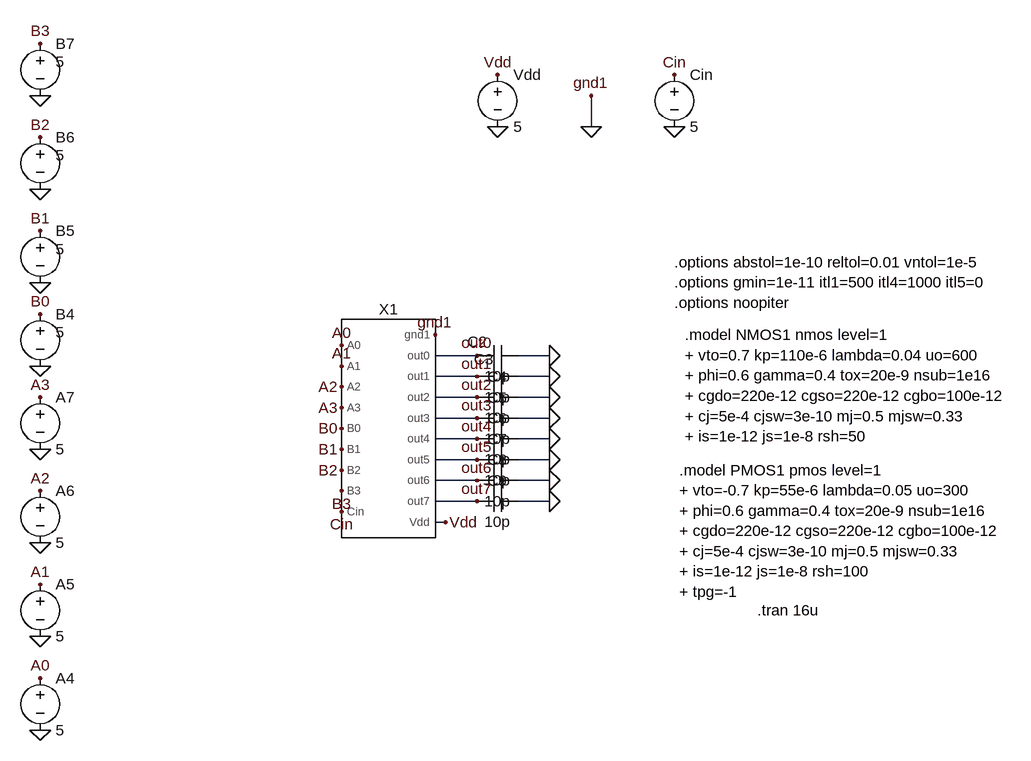
[diagram p0: schematic AddSub_TB.asc]
AddSub_TB.asc, the LTspice schematic file:
Version 4.1
SHEET 1 1768 1716
WIRE 1072 -272 1072 -320
WIRE 896 80 832 80
WIRE 1008 80 960 80
WIRE 896 112 832 112
WIRE 1008 112 960 112
WIRE 896 144 832 144
WIRE 1008 144 960 144
WIRE 896 176 832 176
WIRE 1008 176 960 176
WIRE 896 208 832 208
WIRE 1008 208 960 208
WIRE 896 240 832 240
WIRE 1008 240 960 240
WIRE 896 272 832 272
WIRE 1008 272 960 272
WIRE 896 304 832 304
WIRE 1008 304 960 304
WIRE 848 336 832 336
FLAG 928 -272 0
FLAG 1072 -272 0
FLAG 1072 -320 gnd1
FLAG 1200 -272 0
FLAG 1200 -352 Cin
FLAG 688 64 A0
FLAG 688 96 A1
FLAG 688 128 A2
FLAG 688 160 A3
FLAG 688 192 B0
FLAG 688 224 B1
FLAG 688 256 B2
FLAG 688 288 B3
FLAG 688 320 Cin
FLAG 896 80 out0
FLAG 896 112 out1
FLAG 896 144 out2
FLAG 896 176 out3
FLAG 896 208 out4
FLAG 896 240 out5
FLAG 896 272 out6
FLAG 896 304 out7
FLAG 848 336 Vdd
FLAG 928 -352 Vdd
FLAG 224 -320 0
FLAG 224 -32 0
FLAG 224 96 0
FLAG 224 224 0
FLAG 224 368 0
FLAG 224 512 0
FLAG 224 656 0
FLAG 224 576 A0
FLAG 224 432 A1
FLAG 224 288 A2
FLAG 224 144 A3
FLAG 224 16 B0
FLAG 224 -112 B1
FLAG 224 -256 B2
FLAG 224 -400 B3
FLAG 224 -176 0
FLAG 1008 80 0
FLAG 1008 112 0
FLAG 1008 144 0
FLAG 1008 176 0
FLAG 1008 208 0
FLAG 1008 240 0
FLAG 1008 272 0
FLAG 1008 304 0
FLAG 832 48 gnd1
SYMBOL AddSub 752 192 R0
SYMATTR InstName X1
SYMBOL voltage 928 -368 R0
SYMATTR InstName Vdd
SYMATTR Value 5
SYMBOL voltage 1200 -368 R0
WINDOW 123 0 0 Left 0
WINDOW 39 0 0 Left 0
SYMATTR InstName Cin
SYMATTR Value 5
SYMBOL voltage 224 560 R0
WINDOW 123 0 0 Left 0
WINDOW 39 0 0 Left 0
SYMATTR InstName A4
SYMATTR Value 5
SYMBOL voltage 224 416 R0
WINDOW 123 0 0 Left 0
WINDOW 39 0 0 Left 0
SYMATTR InstName A5
SYMATTR Value 5
SYMBOL voltage 224 272 R0
WINDOW 123 0 0 Left 0
WINDOW 39 0 0 Left 0
SYMATTR InstName A6
SYMATTR Value 5
SYMBOL voltage 224 128 R0
WINDOW 123 0 0 Left 0
WINDOW 39 0 0 Left 0
SYMATTR InstName A7
SYMATTR Value 5
SYMBOL voltage 224 0 R0
WINDOW 3 24 44 Left 2
WINDOW 123 0 0 Left 0
WINDOW 39 0 0 Left 0
SYMATTR Value 5
SYMATTR InstName B4
SYMBOL voltage 224 -128 R0
WINDOW 3 24 44 Left 2
WINDOW 123 0 0 Left 0
WINDOW 39 0 0 Left 0
SYMATTR Value 5
SYMATTR InstName B5
SYMBOL voltage 224 -272 R0
WINDOW 3 24 44 Left 2
WINDOW 123 0 0 Left 0
WINDOW 39 0 0 Left 0
SYMATTR Value 5
SYMATTR InstName B6
SYMBOL voltage 224 -416 R0
WINDOW 3 24 44 Left 2
WINDOW 123 0 0 Left 0
WINDOW 39 0 0 Left 0
SYMATTR Value 5
SYMATTR InstName B7
SYMBOL cap 960 64 R90
WINDOW 0 10 63 VBottom 2
WINDOW 3 32 32 VTop 2
SYMATTR InstName C2
SYMATTR Value 10p
SYMBOL cap 960 96 R90
WINDOW 0 5 53 VBottom 2
WINDOW 3 32 32 VTop 2
SYMATTR InstName C3
SYMATTR Value 10p
SYMBOL cap 960 128 R90
WINDOW 0 0 32 VBottom 2
WINDOW 3 32 32 VTop 2
SYMATTR InstName C4
SYMATTR Value 10p
SYMBOL cap 960 160 R90
WINDOW 0 0 32 VBottom 2
WINDOW 3 32 32 VTop 2
SYMATTR InstName C5
SYMATTR Value 10p
SYMBOL cap 960 192 R90
WINDOW 0 0 32 VBottom 2
WINDOW 3 32 32 VTop 2
SYMATTR InstName C6
SYMATTR Value 10p
SYMBOL cap 960 224 R90
WINDOW 0 0 32 VBottom 2
WINDOW 3 32 32 VTop 2
SYMATTR InstName C7
SYMATTR Value 10p
SYMBOL cap 960 256 R90
WINDOW 0 0 32 VBottom 2
WINDOW 3 32 32 VTop 2
SYMATTR InstName C8
SYMATTR Value 10p
SYMBOL cap 960 288 R90
WINDOW 0 0 32 VBottom 2
WINDOW 3 32 32 VTop 2
SYMATTR InstName C9
SYMATTR Value 10p
TEXT 1216 48 Left 2 !.model NMOS1 nmos level=1\n+ vto=0.7 kp=110e-6 lambda=0.04 uo=600\n+ phi=0.6 gamma=0.4 tox=20e-9 nsub=1e16\n+ cgdo=220e-12 cgso=220e-12 cgbo=100e-12\n+ cj=5e-4 cjsw=3e-10 mj=0.5 mjsw=0.33\n+ is=1e-12 js=1e-8 rsh=50
TEXT 1208 256 Left 2 !.model PMOS1 pmos level=1\n+ vto=-0.7 kp=55e-6 lambda=0.05 uo=300\n+ phi=0.6 gamma=0.4 tox=20e-9 nsub=1e16\n+ cgdo=220e-12 cgso=220e-12 cgbo=100e-12\n+ cj=5e-4 cjsw=3e-10 mj=0.5 mjsw=0.33\n+ is=1e-12 js=1e-8 rsh=100\n+ tpg=-1
TEXT 1328 472 Left 2 !.tran 16u
TEXT 1200 -64 Left 2 !.options abstol=1e-10 reltol=0.01 vntol=1e-5\n.options gmin=1e-11 itl1=500 itl4=1000 itl5=0\n.options noopiter

The netlist it stands for:
* AddSub_TB.asc
X§X1 A0 A1 A2 A3 B0 B1 B2 B3 Cin 0 out0 out1 out2 out3 out4 out5 out6 out7 Vdd AddSub  ; pins A0 A1 A2 A3 B0 B1 B2 B3 Cin gnd1 out0 out1 out2 out3 out4 out5 out6 out7 Vdd
Vdd Vdd 0 5
V§Cin Cin 0 5
V§A4 A0 0 5
V§A5 A1 0 5
V§A6 A2 0 5
V§A7 A3 0 5
V§B4 B0 0 5
V§B5 B1 0 5
V§B6 B2 0 5
V§B7 B3 0 5
C2 0 out0 10p
C3 0 out1 10p
C4 0 out2 10p
C5 0 out3 10p
C6 0 out4 10p
C7 0 out5 10p
C8 0 out6 10p
C9 0 out7 10p
.model NMOS1 nmos level=1
+ vto=0.7 kp=110e-6 lambda=0.04 uo=600
+ phi=0.6 gamma=0.4 tox=20e-9 nsub=1e16
+ cgdo=220e-12 cgso=220e-12 cgbo=100e-12
+ cj=5e-4 cjsw=3e-10 mj=0.5 mjsw=0.33
+ is=1e-12 js=1e-8 rsh=50
.model PMOS1 pmos level=1
+ vto=-0.7 kp=55e-6 lambda=0.05 uo=300
+ phi=0.6 gamma=0.4 tox=20e-9 nsub=1e16
+ cgdo=220e-12 cgso=220e-12 cgbo=100e-12
+ cj=5e-4 cjsw=3e-10 mj=0.5 mjsw=0.33
+ is=1e-12 js=1e-8 rsh=100
+ tpg=-1
.tran 16u
.options abstol=1e-10 reltol=0.01 vntol=1e-5
.options gmin=1e-11 itl1=500 itl4=1000 itl5=0
.options noopiter
.backanno
.end